# EAGLE design LAMPU_EMERGENCY_v1.2_all_module (EAGLE 9.6.1)
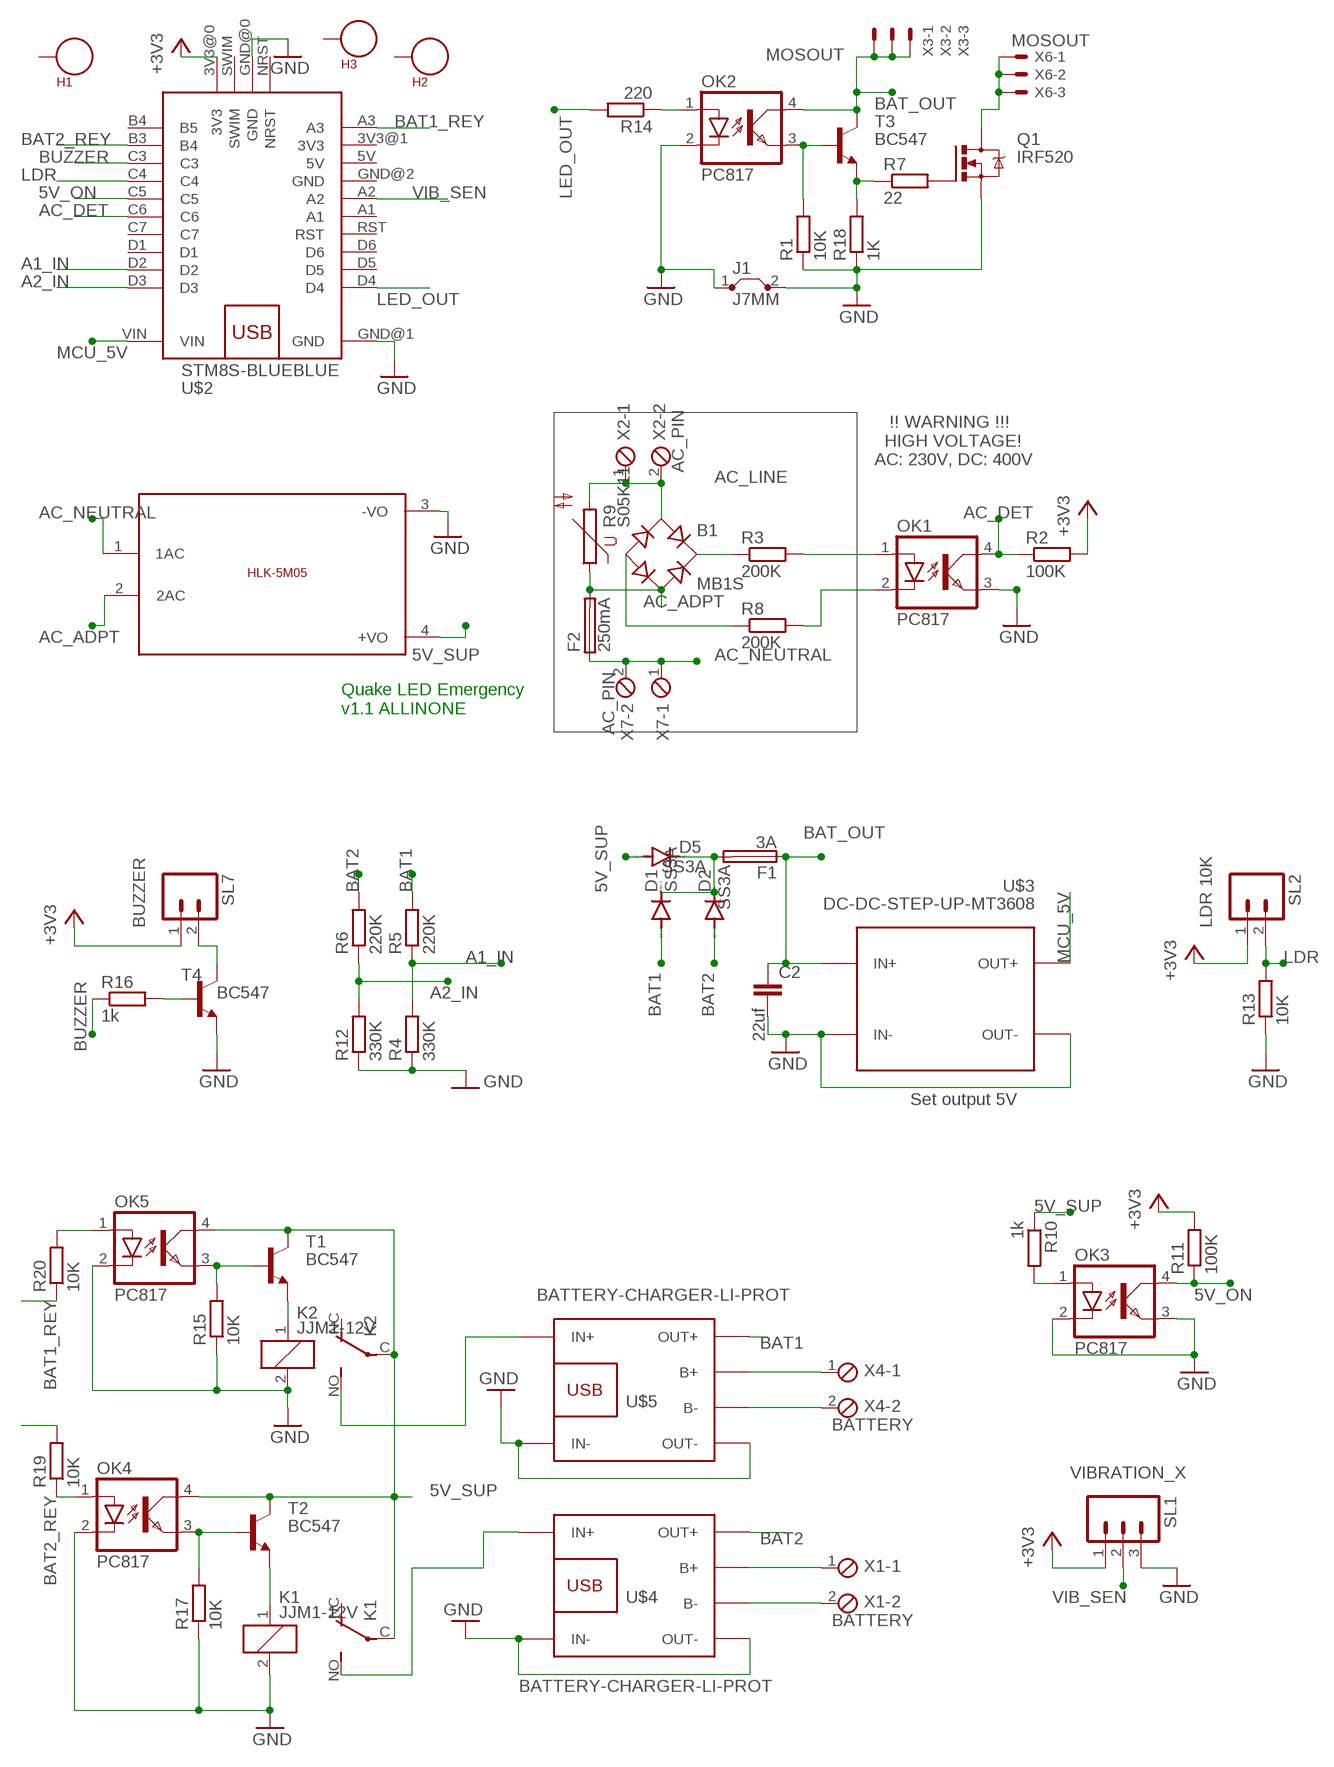
[diagram p0: schematic, sheet 1]

## Parts
B1  MB1S  [SOIC-4]
C2  22uf  C-EUC0805K  [C0805K]
D1  SS3A  ES2D  [SMB]
D2  SS3A  ES2D  [SMB]
D5  SS3A  ES2D  [SMB]
F1  3A  FUSEGSH15  [GSH15]
F2  250mA  TR5  [TR5]
H1  SEW_HOLE  [SIMPLE_HOLE]
H2  SEW_HOLE  [SIMPLE_HOLE]
H3  SEW_HOLE  [SIMPLE_HOLE]
J1  J7MM  [07]
K1  JJM1-12V  [JJM1C]
K2  JJM1-12V  [JJM1C]
OK1  PC817  [DIL04]
OK2  PC817  [DIL04]
OK3  PC817  [DIL04]
OK4  PC817  [DIL04]
OK5  PC817  [DIL04]
Q1  IRF520  [TO220BV]
R1  10K  R-EU_0207/7  [0207/7]
R2  100K  R-EU_0207/7  [0207/7]
R3  200K  R-EU_0922V  [0922V]
R4  330K  R-EU_0207/7  [0207/7]
R5  220K  R-EU_0207/7  [0207/7]
R6  220K  R-EU_0207/7  [0207/7]
R7  22  R-EU_0207/7  [0207/7]
R8  200K  R-EU_0922V  [0922V]
R9  S05K11  [S05K11]
R10  1k  R-EU_0207/7  [0207/7]
R11  100K  R-EU_0207/7  [0207/7]
R12  330K  R-EU_0207/7  [0207/7]
R13  10K  R-EU_0207/7  [0207/7]
R14  220  R-EU_0207/7  [0207/7]
R15  10K  R-EU_0207/7  [0207/7]
R16  1k  R-EU_0207/7  [0207/7]
R17  10K  R-EU_0207/7  [0207/7]
R18  1K  R-EU_0207/7  [0207/7]
R19  10K  R-EU_0207/7  [0207/7]
R20  10K  R-EU_0207/7  [0207/7]
SL1  VIBRATION_X  M03  [03P]
SL2  LDR 10K  M02  [02P]
SL7  BUZZER  M02  [02P]
T1  BC547  [TO92]
T2  BC547  [TO92]
T3  BC547  [TO92]
T4  BC547  [TO92]
U$1  5VDC/5W  HLK-5M05  [HLK-5M05]
U$2  STM8S-BLUEBLUE  [WEMOS-D1-MINI]
U$3  DC-DC-STEP-UP-MT3608  [DC-DC-STEP-UP-MT3608]
U$4  BATTERY-CHARGER-LI-PROT  [BATTERY-CHARGER-LI-PROT]
U$5  BATTERY-CHARGER-LI-PROT  [BATTERY-CHARGER-LI-PROT]
X1  BATTERY  MPT2  [2POL254]
X2  AC_PIN  MPT2  [2POL254]
X3  MOSOUT  22-23-2031  [22-23-2031]
X4  BATTERY  MPT2  [2POL254]
X6  MOSOUT  22-23-2031  [22-23-2031]
X7  AC_PIN  MPT2  [2POL254]

## Nets
5V_ON: OK3.4(COL) R11.1 U$2.C5
5V_SUP: D5.A K1.C(2:P) K2.C(2:P) OK4.4(COL) OK5.4(COL) R10.1 T1.3(C) T2.3(C) U$1.4(+VO)
+3V3: R2.2 R11.2 SL1.1 SL2.1 SL7.1 U$2.3V3@0(3V3)
A1_IN: R4.2 R5.1 U$2.D2
A2_IN: R6.1 R12.2 U$2.D3
AC_ADPT: B1.~2(AC2) F2.2 R9.1 U$1.2(2AC)
AC_DET: OK1.4(COL) R2.1 U$2.C6
AC_LINE: B1.~1(AC1) R9.2 X2.1 X2.2
AC_NEUTRAL: F2.1 U$1.1(1AC) X7.1 X7.2
BAT1: D1.A R5.2 U$5.OUT+
BAT1_REY: R20.1 U$2.A3
BAT2: D2.A R6.2 U$4.OUT+
BAT2_REY: R19.2 U$2.B3(B4)
BAT_OUT: C2.1 F1.1 OK2.4(COL) T3.3(C) U$3.IN+ X3.1 X3.2 X3.3
BUZZER: R16.1 U$2.C3
GND: C2.2 J1.1 J1.2 K1.2 K2.2 OK1.3(EMIT) OK2.2(C) OK3.2(C) OK3.3(EMIT) OK4.2(C) OK5.2(C) Q1.S R1.1 R4.1 R12.1 R13.1 R15.1 R17.1 R18.1 SL1.3 T4.1(E) U$1.3(-VO) U$2.GND@0(GND) U$2.GND@1(GND) U$3.IN- U$3.OUT- U$4.IN- U$4.OUT- U$5.IN- U$5.OUT-
LDR: R13.2 SL2.2 U$2.C4
LED_OUT: R14.2 U$2.D4
MCU_5V: U$2.VIN U$3.OUT+
N$1: OK2.3(EMIT) R1.2 T3.2(B)
N$2: OK3.1(A) R10.2
N$3: B1.+ R3.1
N$4: B1.- R8.1
N$5: OK1.2(C) R8.2
N$6: K1.NO(2:S) U$4.IN+
N$7: OK1.1(A) R3.2
N$9: K2.NO(2:S) U$5.IN+
N$10: U$4.B- X1.2
N$11: U$4.B+ X1.1
N$12: U$5.B- X4.2
N$13: U$5.B+ X4.1
N$14: OK5.3(EMIT) R15.2 T1.2(B)
N$15: SL7.2 T4.3(C)
N$16: K2.1 T1.1(E)
N$17: D1.C D2.C D5.C F1.2
N$18: R16.2 T4.2(B)
N$21: R7.1 R18.2 T3.1(E)
N$22: Q1.G R7.2
N$23: OK2.1(A) R14.1
N$24: Q1.D X6.1 X6.2 X6.3
N$26: OK4.3(EMIT) R17.2 T2.2(B)
N$27: K1.1 T2.1(E)
N$29: OK5.1(A) R20.2
N$30: OK4.1(A) R19.1
VIB_SEN: SL1.2 U$2.A2
Unconnected: H1.P$1 H2.P$1 H3.P$1 K1.NC(2:O) K2.NC(2:O) U$2.A1 U$2.B4(B5) U$2.C7 U$2.D1 U$2.D5 U$2.D6 U$2.NRST U$2.RST U$2.SWIM

## Notes on the sheet
- !! WARNING !!!
    HIGH VOLTAGE!
  AC: 230V, DC: 400V
- Quake LED Emergency
  v1.1 ALLINONE
- Set output 5V

## Power pins joined to a net without a drawn wire
3V3: U$2.3V3@1(3V3)
5V: U$2.5V
GND: U$2.GND@2(GND)

## Library data of the parts
B1 = rectifier:MB*S: Bridge Rectifier Source: http://www.fairchildsemi.com/ds/MB/MB6S.pdf
C2 = rcl:C-EU: CAPACITOR, European symbol; SPICEPREFIX: C
D1 D2 D5 = diode:ES2D: DIODE super fast rectifier, 2 A
F1 = fuse:FUSE: Fuse; OC_FARNELL: unknown; OC_NEWARK: unknown
F2 = fuse:TR5: FUSE Wickmann; OC_FARNELL: unknown; OC_NEWARK: unknown
H1-H3 = LilyPad-Wearables:SEW_HOLE: Simple sew-hole .1" diameter hole with 20mil annular ring
J1 = jumper:J: Bridge
K1 K2 = relay:JJM1-12V: HALF-SIZE AUTOMOTIVE RELAY NAiS Source: http://www.mew-europe.com/.. en_ds_61210_0001.pdf; MF: AROMAT/ MATSUSHITA; MPN: JJM1-12V; OC_FARNELL: unknown; OC_NEWARK: 10C7318
OK1-OK5 = optocoupler:PC817: SHARP OPTO COUPLER; MPN: PC817X4J000F; OC_FARNELL: 9707727; OC_NEWARK: 97K7059; SPICEPREFIX: O
Q1 = transistor-power:IRF520: HEXFET Power MOSFET; SPICEPREFIX: Q
R1-R8 R10-R20 = rcl:R-EU_: RESISTOR, European symbol; SPICEPREFIX: R
R9 = varistor:S05K11: VARISTOR
SL1 = con-amp-quick:M03: AMP QUICK CONNECTOR; OC_FARNELL: unknown; OC_NEWARK: unknown
SL2 SL7 = con-amp-quick:M02: AMP QUICK CONNECTOR; OC_FARNELL: unknown; OC_NEWARK: unknown
T1-T4 = transistor:BC547: NPN TRANSISTOR; SPICEPREFIX: J
U$1 = HLK-5M05:HLK-5M05: HLK-5M05 is an 5Volt/5W smps developed by HI-LINK; SIZE: 23x38(mm)
U$2 = STM8-blue:STM8S-BLUE
U$3 = diy-modules:DC-DC-STEP-UP-MT3608: DC/DC Step-Up Regulator based on MT3608 chip MT3608 datasheet available here: https://www.olimex.com/Products/Breadboarding/BB-PWR-3608/resources/MT3608.pdf Click here to find device on ebay.com <http://www.ebay.com/sch/mt3608+module>
U$4 U$5 = diy-modules:BATTERY-CHARGER-LI-PROT: Lithium Battery 5V Charger with protection circuit More details available here: http://www.instructables.com/id/DIY-Lithium-ion-Battery-Charger/step4/TP4056-based-lithium-ion-battery-charger-module/ Click here to find device on ebay.com <http://www.ebay.com/sch/tp4056+charger+usb+protection>
X1 X2 X4 X7 = con-phoenix-254:MPT2: PHOENIX CONNECTOR; OC_FARNELL: unknown; OC_NEWARK: unknown
X3 X6 = con-molex:22-23-2031: .100" (2.54mm) Center Header - 3 Pin; MF: MOLEX; MPN: 22-23-2031; OC_FARNELL: 1462950; OC_NEWARK: 30C0862

## Board
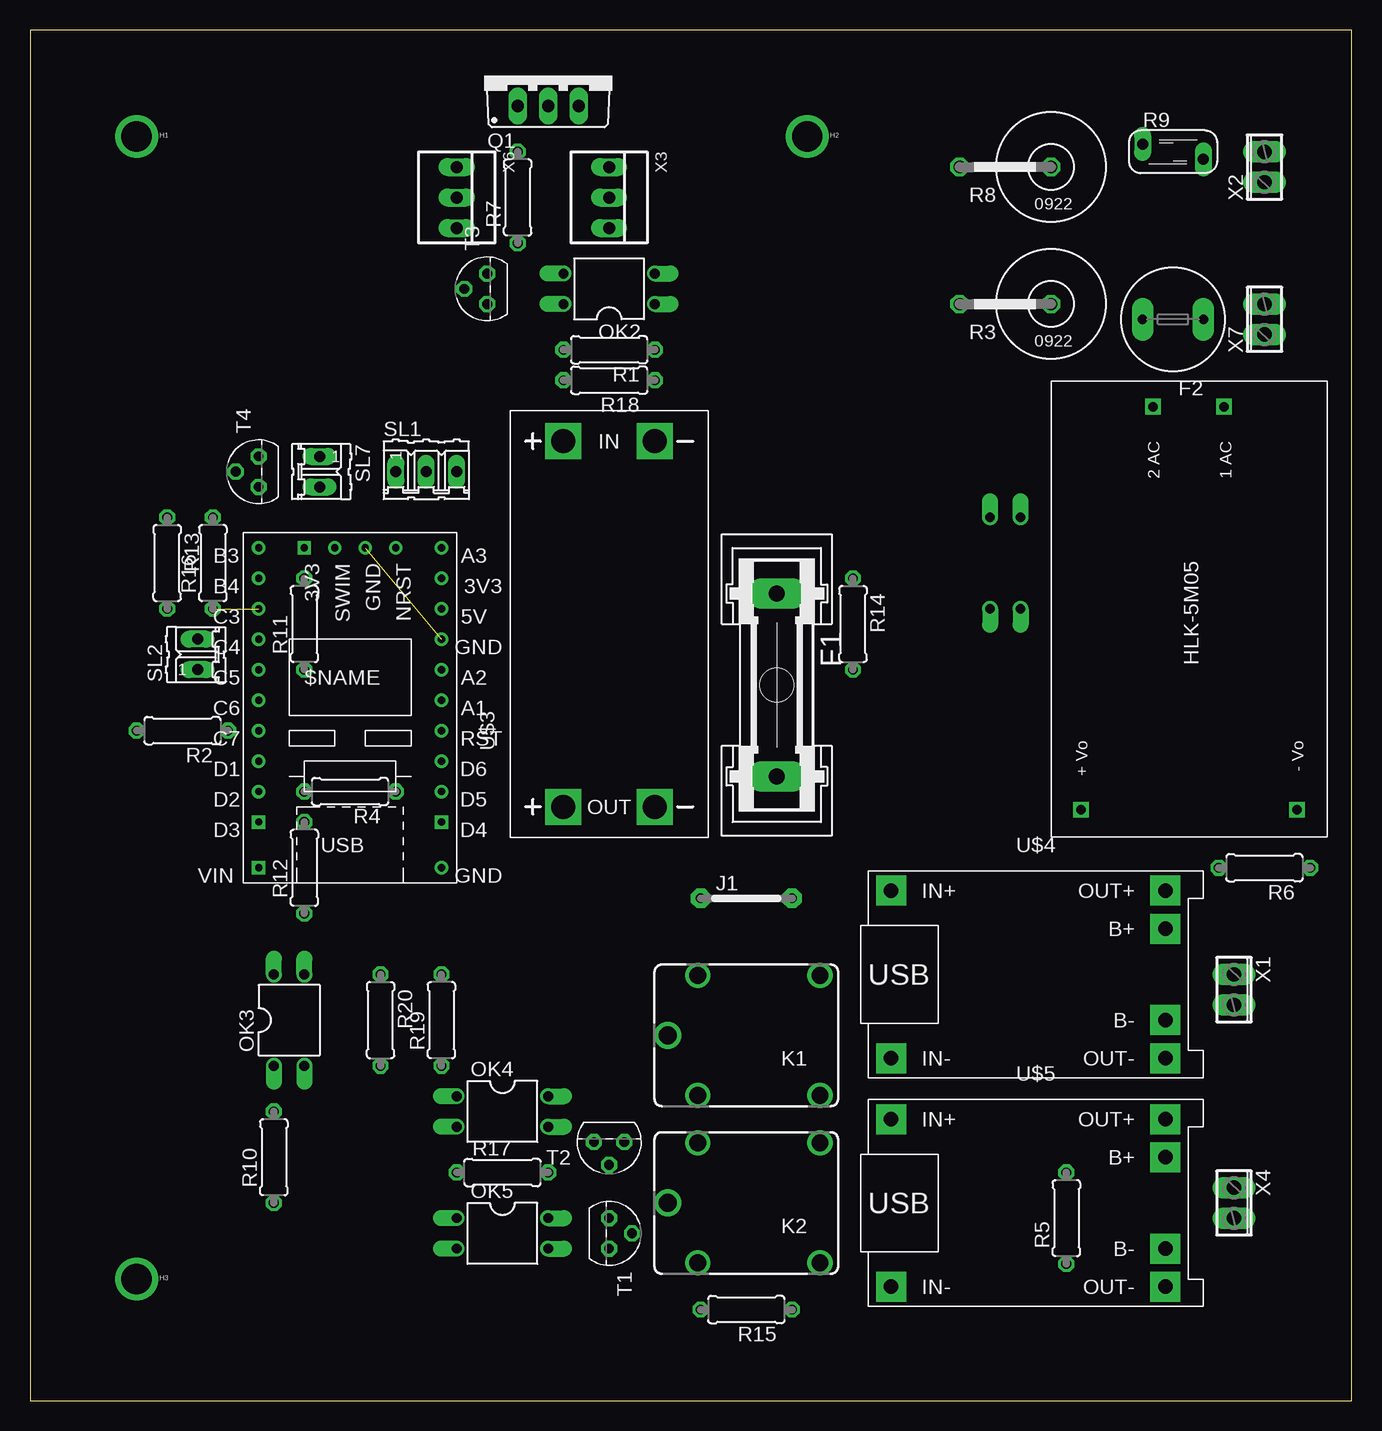
[diagram p1: board, top side]
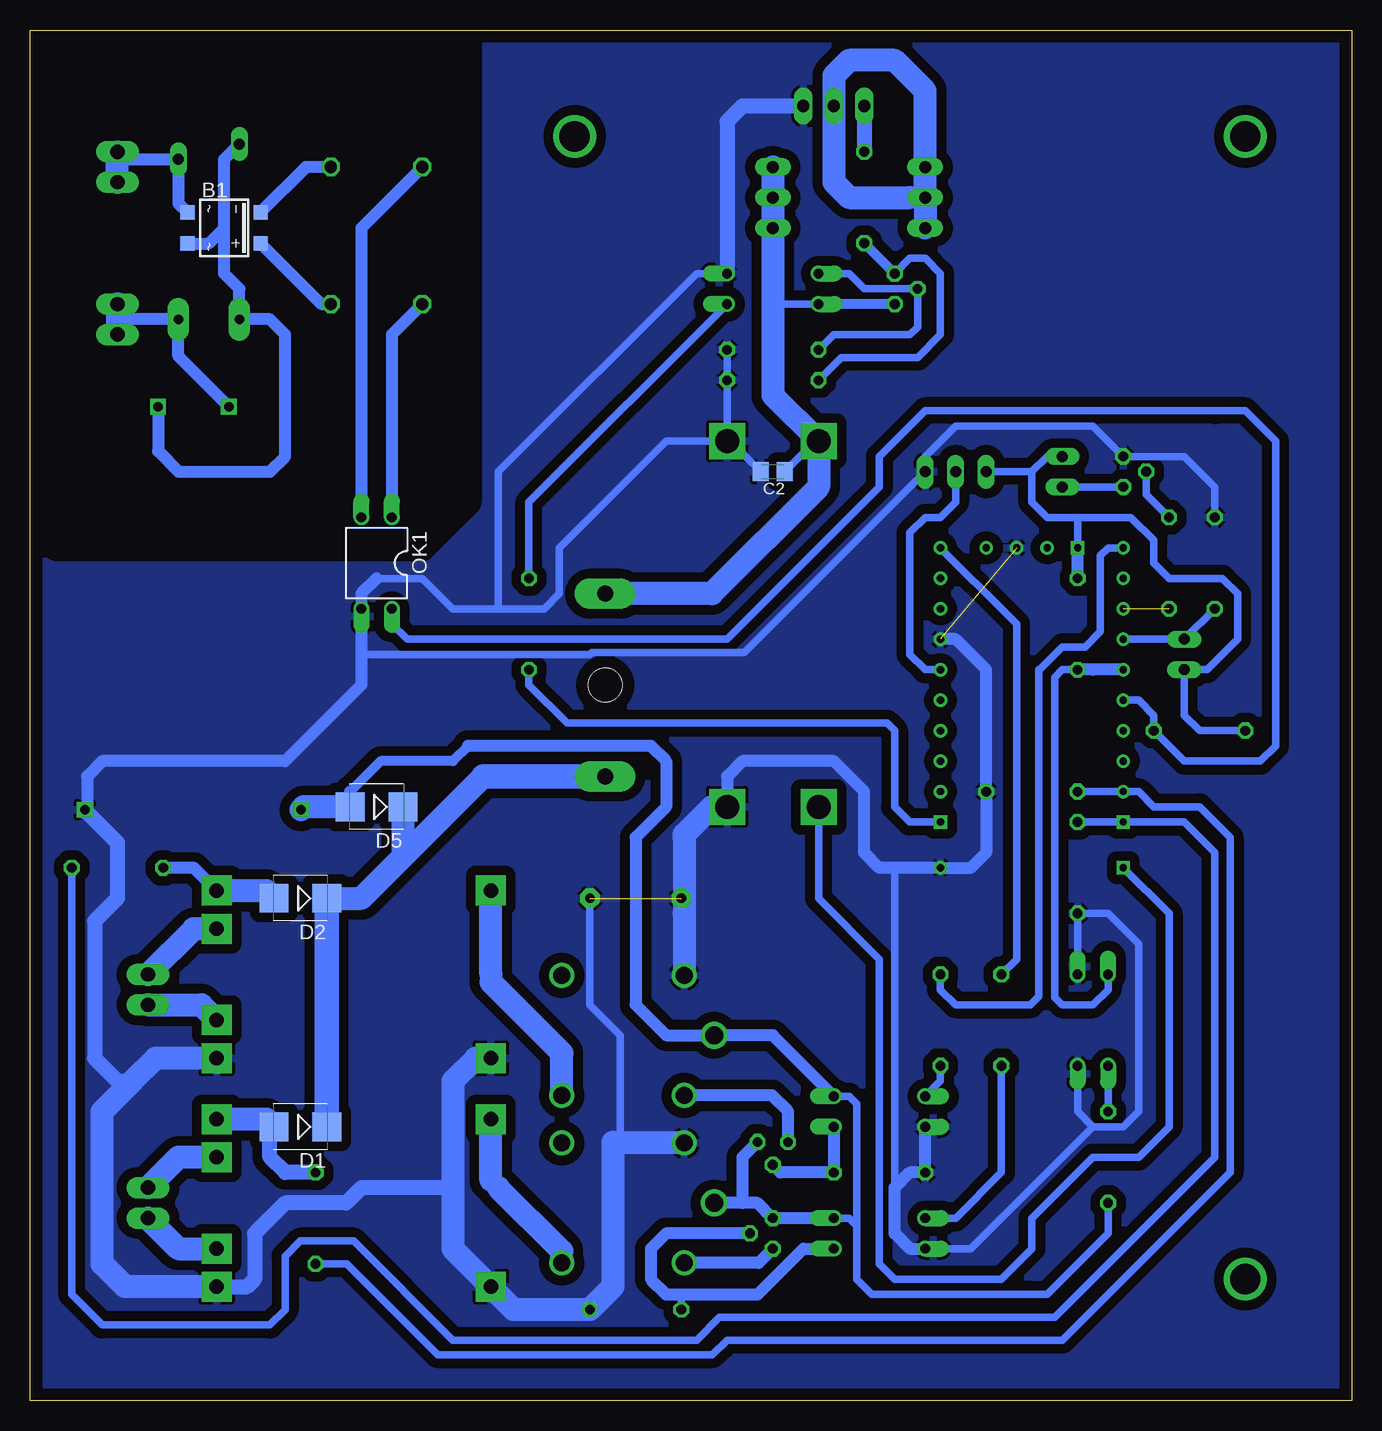
[diagram p2: board, bottom side, seen from below]

Size 110.16 x 114.29 mm. Coordinates in mm from the lower left corner, seen from the top.
Outline: 0,0 110.16,0 110.16,114.29 0,114.29 0,0
Copper layers (1*16): Top 0.035mm / dielectric 1.5mm / Bottom 0.035mm
Design rules "default": minimum track width 6mil, minimum drill 0.35mm, track to track 6mil, track to pad 6mil, pad to pad 6mil, via to via 6mil, smd to smd 6mil, copper to edge 40mil, drill to drill 6mil, minimum pad ring 10mil, minimum via ring 8mil, stop-mask expansion 4mil, vias tented up to drill 0mil, thermal gap 10mil
bRestrict: area 73.7,71.1 to 109.2,113

### Footprints (pad centres in the part's own frame; a part is rotated, then mirrored left to right if it is on the bottom)
SOIC-4 = smd 1.2 x 1.2: + 1.3,3.05; - -1.3,3.05; ~1 -1.3,-3.05; ~2 1.3,-3.05
C0805K = smd 1.3 x 1.6: 1 -1,0; 2 1,0
SMB = smd 2.4 x 2.4: A 2.2,0; C -2.2,0
GSH15 = drill 1.321 pad 2.54 long: 1 -7.62,0; 2 7.62,0 | hole 2.794: 0,0
TR5 = drill 0.813 pad 1.778 long: 1 -2.54,0; 2 2.54,0
SIMPLE_HOLE = drill 2.54 pad 3.048: P$1 0,0
07 = drill 0.813 pad 1.6 octagon: 1 -3.81,0; 2 3.81,0
JJM1C = drill 1.4: 1 4.05,5; 2 4.05,-5; NC -6.15,-5; NO -6.15,5 | drill 1.5: C 6.55,0
DIL04 = drill 0.813 offset: 1 -1.27,-3.81; 2 1.27,-3.81; 3 1.27,3.81; 4 -1.27,3.81
TO220BV = drill 1.016 long: D 0,-2.54; G -2.54,-2.54; S 2.54,-2.54
0207/7 = drill 0.813 octagon: 1 -3.81,0; 2 3.81,0
0922V = drill 1.016 octagon: 1 -5.08,0; 2 2.54,0
S05K11 = drill 0.914 long: 1 -0.635,-2.54; 2 0.635,2.54
03P = drill 0.914 long: 1 -2.54,0; 2 0,0; 3 2.54,0
02P = drill 0.914 long: 1 -1.27,0; 2 1.27,0
TO92 = drill 0.813 octagon: 1 1.27,0; 2 0,1.905; 3 -1.27,0
HLK-5M05 = drill 0.8 square: 1 -16.85,-2.93; 2 -16.85,2.97; 3 16.75,9.07; 4 16.75,-8.93
WEMOS-D1-MINI = drill 0.6 square: 3V3@0 -3.81,11.43; D3 -7.62,-11.43; D4 7.62,-11.43; VIN -7.62,-15.24 | drill 0.6: 3V3@1 7.62,8.89; 5V 7.62,6.35; A1 7.62,-1.27; A2 7.62,1.27; A3 7.62,11.43; B3 -7.62,11.43; B4 -7.62,8.89; C3 -7.62,6.35; C4 -7.62,3.81; C5 -7.62,1.27; C6 -7.62,-1.27; C7 -7.62,-3.81; D1 -7.62,-6.35; D2 -7.62,-8.89; D5 7.62,-8.89; D6 7.62,-6.35; GND@0 1.27,11.43; GND@1 7.62,3.81; GND@2 7.62,-15.24; NRST 3.81,11.43; RST 7.62,-3.81; SWIM -1.27,11.43
DC-DC-STEP-UP-MT3608 = drill 2 pad 2.8 square: IN+ 15.24,3.81; IN- 15.24,-3.81; OUT+ -15.24,3.81; OUT- -15.24,-3.81
BATTERY-CHARGER-LI-PROT = drill 1.2 pad 2.5 square: B+ 10.795,3.81; B- 10.795,-3.81; IN+ -12.065,6.985; IN- -12.065,-6.985; OUT+ 10.795,6.985; OUT- 10.795,-6.985
2POL254 = drill 1.2 long: 1 -1.27,0; 2 1.27,0
22-23-2031 = drill 1 long: 1 -2.54,0; 2 0,0; 3 2.54,0

### Placement (x,y rotation side)
B1  93.98,97.79 270 bottom
C2  48.26,77.47 180 bottom
D1  87.63,22.86 180 bottom
D2  87.63,41.91 180 bottom
D5  81.28,49.53 180 bottom
F1  62.23,59.69 270 top
F2  95.25,90.17 180 top
H1  8.89,105.41 0 top
H2  64.77,105.41 0 top
H3  8.89,10.16 0 top
J1  59.69,41.91 0 top
K1  59.69,30.48 180 top
K2  59.69,16.51 180 top
OK1  81.28,69.85 180 bottom
OK2  48.26,92.71 90 top
OK3  21.59,31.75 0 top
OK4  39.37,24.13 270 top
OK5  39.37,13.97 270 top
Q1  43.18,110.49 0 top
R1  48.26,87.63 180 top
R2  12.7,55.88 180 top
R3  80.01,91.44 180 top
R4  26.67,50.8 180 top
R5  86.36,15.24 90 top
R6  102.87,44.45 180 top
R7  40.64,100.33 90 top
R8  80.01,102.87 180 top
R9  95.25,104.14 270 top
R10  20.32,20.32 90 top
R11  22.86,64.77 90 top
R12  22.86,44.45 90 top
R13  11.43,69.85 270 top
R14  68.58,64.77 270 top
R15  59.69,7.62 180 top
R16  15.24,69.85 90 top
R17  39.37,19.05 0 top
R18  48.26,85.09 180 top
R19  34.29,31.75 90 top
R20  29.21,31.75 270 top
SL1  33.02,77.47 0 top
SL2  13.97,62.23 90 top
SL7  24.13,77.47 270 top
T1  48.26,13.97 270 top
T2  48.26,21.59 180 top
T3  38.1,92.71 90 top
T4  19.05,77.47 90 top
U$1  96.52,66.04 270 top
U$2  26.67,59.69 0 top
U$3  48.26,64.77 90 top
U$4  83.82,35.56 0 top
U$5  83.82,16.51 0 top
X1  100.33,34.29 270 top
X2  102.87,102.87 90 top
X3  48.26,100.33 270 top
X4  100.33,16.51 270 top
X6  35.56,100.33 270 top
X7  102.87,90.17 90 top

### Tracks (layer width: path | path; a pad name or v marks a point on that pad's centre or on a via)
5V_ON
  Bottom 0.61: OK3.4 20.32,34.29 21.59,33.02 24.13,33.02 24.77,33.66 24.77,52.07 24.77,52.7 24.77,60.32 24.13,60.96 R11.1
  Bottom 1.016: U$2.C5 21.59,60.96 R11.1
5V_SUP
  Bottom 0.61: 41.28,14.61 41.28,10.16 40.01,8.89 26.67,8.89 25.4,8.89 20.32,13.97 R10.1 | 41.28,14.61 41.91,15.24 OK5.4 | 41.28,14.61 41.28,24.77 41.91,25.4 OK4.4
  Bottom 0.813: 73.66,54.61 74.93,53.34 80.94,53.34 83.48,50.8
  Bottom 1.016: 50.8,16.51 49.53,16.51 T1.3 OK5.4 | 50.8,16.51 K2.C | T2.3 50.8,20.32 50.8,16.51 | OK4.4 48.26,30.48 K1.C 57.15,30.48 59.69,33.02 59.69,46.99 57.15,49.53 57.15,53.34 58.42,54.61 73.66,54.61 | 83.48,50.8 D5.A
  Bottom 1.93: D5.A 87.35,49.53 U$1.4
+3V3
  Bottom 0.61: 29.21,77.47 SL1.1 26.67,77.47 | SL7.1 25.4,78.74 26.67,77.47 | 22.86,72.39 U$2.3V3@0 22.86,73.66 | 22.86,73.66 24.13,73.66 | 24.13,73.66 25.4,73.66 26.67,74.93 26.67,77.47 | R2.2 12.7,55.88 13.97,57.15 SL2.1 12.07,60.96 9.53,63.5 9.53,67.31 10.8,68.58 15.24,68.58 16.51,69.85 16.51,71.76 18.42,73.66 22.86,73.66 | 24.13,73.66
  Bottom 1.016: R11.2 U$2.3V3@0
A1_IN
  Bottom 0.61: R5.1 83.77,11.43 76.2,3.86 53.29,3.86 52.07,5.08 24.13,5.08 10.16,19.05 10.16,46.99 12.7,49.53 16.51,49.53 17.78,50.8 U$2.D2 R4.2
A2_IN
  Bottom 0.61: R6.1 106.68,8.89 104.14,6.35 90.17,6.35 88.9,7.62 88.9,12.07 87.63,13.34 83.19,13.34 74.93,5.08 54.61,5.08 52.7,6.99 24.77,6.99 11.43,20.32 11.43,45.72 13.97,48.26 U$2.D3 R12.2
AC_ADPT
  Bottom 1.016: B1.~2 95.28,96.49 93.98,97.79 | R9.1 93.98,103.51 93.98,97.79 | 93.98,97.79 93.98,93.98 92.71,92.71 F2.2 90.17,90.17 88.9,88.9 88.9,78.74 90.17,77.47 97.79,77.47 99.49,79.17 U$1.2
AC_DET
  Bottom 0.61: U$2.C6 17.78,58.42 16.51,57.15 R2.1 13.97,53.34 8.89,53.34 7.62,53.34 6.35,54.61 6.35,80.01 8.89,82.55 11.43,82.55 35.56,82.55 39.37,78.74 39.37,76.2 52.07,63.5 78.74,63.5 80.01,64.77 OK1.4
AC_LINE
  Bottom 1.016: X2.1 104.14,101.6 | X2.2 102.24,103.51 R9.2 97.79,99.85 B1.~1
  Bottom 1.93: X2.1 X2.2
AC_NEUTRAL
  Bottom 1.016: 102.87,90.17 F2.1 97.79,87.09 U$1.1
  Bottom 1.93: X7.2 102.87,90.17 X7.1
BAT1
  Bottom 1.27: D1.A 90.17,22.52 90.17,20.32 88.9,19.05 R5.2
  Bottom 1.93: U$5.OUT+ 90.47,23.49 D1.A
BAT1_REY
  Bottom 0.61: R20.1 27.94,36.83 27.94,64.77 28.58,65.41 | U$2.A3 28.58,65.41 | 28.58,65.41
BAT2
  Bottom 1.016: 90.47,42.55 D2.A | U$4.OUT+ 96.52,44.45 R6.2
  Bottom 1.93: U$4.OUT+ 90.47,42.55
BAT2_REY
  Bottom 0.61: R19.2 34.29,34.29 33.02,33.02 26.8,33.02 26.1,33.72 26.1,60.96 26.03,60.96 24.13,62.87 22.23,62.87 20.96,64.14 20.96,70.48 20.32,71.12 U$2.B3
BAT_OUT
  Bottom 0.61: OK2.4 48.26,91.44 | C2.1 44.72,80.01 U$3.IN+
  Bottom 0.813: T3.3 OK2.4
  Bottom 1.93: X3.1 X3.2 X3.3 48.26,91.44 48.26,83.82 U$3.IN+ 44.45,76.2 53.34,67.31 F1.1
BUZZER  (1 unrouted)
GND  (2 unrouted)
  Bottom 0.61: OK2.2 54.61,93.98 71.12,77.47 71.12,66.04 | 81.28,68.58 77.47,68.58 74.93,66.04 71.12,66.04 | 55.64,47.23 55.64,46.99 | R13.1 11.43,76.2 13.97,78.74 T4.1 21.59,81.28 33.02,81.28 35.56,78.74 SL1.3 50.62,62.41 63.36,62.41 63.53,62.23 82.55,62.23 | U$3.IN- 57.15,80.01 66.04,71.12 66.04,67.31 67.31,66.04 71.12,66.04 | R1.1 R18.1 U$3.IN- | OK3.2 22.86,24.13 21.59,22.86 | OK3.3 R12.1 20.32,40.64 17.78,38.1 17.78,24.13 19.05,22.86 21.59,22.86 | C2.2 51.8,80.01 U$3.IN- | 21.59,22.86 31.75,12.7 OK5.2 | 38.1,17.78 38.1,44.45 | J1.1 55.64,41.67 55.64,40.64 | J1.2 63.5,33.02 60.96,30.48 60.96,20.32 61.59,20.95 61.59,21.59
  Bottom 1.016: 72.39,10.16 U$5.IN- | OK4.2 R17.1 36.83,19.05 38.1,17.78 38.1,13.97 36.83,12.7 OK5.2 | 55.56,35.56 K1.2 | 81.28,68.58 82.55,67.31 OK1.3 82.55,62.23 82.55,59.69 88.9,53.34 104.14,53.34 105.41,52.07 105.41,49.47 U$1.3 | U$3.OUT- 52.07,52.07 50.8,53.34 43.18,53.34 40.64,50.8 40.64,45.72 39.37,44.45 38.1,44.45 U$2.GND@2 31.75,44.45 30.48,45.72 R4.1 30.48,60.96 33.02,63.5 U$2.GND@1
  Bottom 1.27: U$5.OUT- 92.08,9.53 91.44,10.16 91.44,13.97 88.9,16.51 83.82,16.51 82.55,17.78 74.93,17.78 | U$1.3 102.87,46.57 102.87,41.91 104.78,40.01 104.78,28.57 102.87,26.67 101.6,26.67 | Q1.S 50.8,107.95 52.07,106.68 OK2.2
  Bottom 1.93: U$4.OUT- 99.69,28.57 101.6,26.67 104.14,24.13 104.14,11.43 102.24,9.53 U$5.OUT- | U$4.IN- 73.03,28.57 74.93,26.67 74.93,17.78 74.93,12.7 72.39,10.16 | K2.2 61.52,21.51 61.59,21.59 61.59,9.53 R15.1 69.85,7.62 U$5.IN- | U$3.OUT- 53.34,49.53 55.64,47.23 | 55.64,46.99 55.64,40.64 K1.2
  pour Bottom (isolate 0.813, rank 6): 1.27,123.19 1.27,-2.54 2.54,-3.81 114.3,-3.81 115.57,-5.08 115.57,121.92 114.3,123.19
LDR
  Bottom 0.61: R13.2 SL2.2 U$2.C4
LED_OUT
  Bottom 0.61: R14.2 68.58,59.69 65.41,56.52 38.73,56.52 38.1,55.88 38.1,49.53 36.83,48.26 U$2.D4
MCU_5V
  Bottom 0.61: U$2.VIN 15.24,40.64 15.24,22.86 17.78,20.32 21.59,20.32 26.67,15.24 26.67,12.7 29.21,10.16 38.1,10.16 39.37,11.43 39.37,36.83 44.45,41.91 U$3.OUT+
N$1
  Bottom 0.61: OK2.3 41.91,93.98 40.64,92.71 T3.2 36.2,89.54 36.83,88.9 43.18,88.9 R1.2
N$2
  Bottom 0.61: R10.2 OK3.1
N$3
  Bottom 1.016: B1.+ 85.88,91.44 R3.1
N$4
  Bottom 1.016: R8.1 87.15,102.87 B1.-
N$5
  Bottom 1.016: R8.2 82.55,97.79 OK1.2
N$6
  Bottom 1.016: 71.76,34.92 71.76,35.56 | 71.76,41.91 U$4.IN+
  Bottom 1.93: K1.NO 65.84,29.01 71.76,34.92 | 71.76,35.56 71.76,41.91
N$7
  Bottom 1.016: R3.2 80.01,88.9 OK1.1
N$9
  Bottom 1.016: 71.12,17.78 71.76,18.41
  Bottom 1.93: K2.NO 65.84,12.5 71.12,17.78 | 71.76,18.41 U$5.IN+
N$10
  Bottom 1.93: X1.2 95.88,33.02 U$4.B-
N$11
  Bottom 1.93: U$4.B+ 96.52,39.37 X1.1
N$12
  Bottom 1.93: X4.2 97.79,12.7 U$5.B-
N$13
  Bottom 1.93: U$5.B+ 97.79,20.32 X4.1
N$14
  Bottom 0.61: R15.2 55.88,8.89
  Bottom 1.016: OK5.3 45.72,12.7 49.53,8.89 55.88,8.89 57.15,8.89 58.42,10.16 58.42,12.7 57.15,13.97 T1.2
N$15
  Bottom 0.61: SL7.2 T4.3
N$16
  Bottom 1.016: T1.1 49.45,11.51 K2.1
N$17
  Bottom 1.016: D2.C 85.09,42.25
  Bottom 1.93: D5.C 79.08,46.06 78.74,45.72 | D2.C 82.55,41.91 78.74,45.72 | 78.74,45.72 72.39,52.07
  Bottom 2.032: F1.2 72.39,52.07 | D1.C D2.C
N$18
  Bottom 0.61: T4.2 17.15,75.57 R16.2
N$21
  Bottom 0.61: T3.1 36.83,95.25 35.56,95.25 34.29,93.98 34.29,88.9 36.2,87 42.55,87 R18.2
  Bottom 0.813: T3.1 R7.1
N$22
  Bottom 1.27: Q1.G R7.2
N$23
  Bottom 0.61: OK2.1 68.58,74.93 R14.1
N$24
  Bottom 1.93: X6.2 X6.1 | X6.2 X6.3 | X6.2 35.56,109.22 38.1,111.76 41.91,111.76 43.18,110.49 Q1.D 43.18,101.6 41.91,100.33 36.83,100.33
N$26
  Bottom 1.016: T2.2 47.62,19.05 R17.2 OK4.3
N$27
  Bottom 1.016: T2.1 46.99,24.13 48.34,25.48 K1.1
N$29
  Bottom 0.61: OK5.1 33.02,15.24 29.21,19.05 R20.2
N$30
  Bottom 0.61: R19.1 34.29,26.67 OK4.1
VIB_SEN
  Bottom 0.61: SL1.2 33.02,74.93 34.29,73.66 35.56,73.66 36.83,72.39 36.83,62.23 35.56,60.96 U$2.A2